# Altium schematic sheet BlindController.SchDoc: Blind Control Unit (VELUX)
size A4; Author: Vaclav Dvorak; DrawnBy: Vaclav Dvorak; Organization: ST Microelectronics; Address1: Pobrezni 3; Address2: 18600, Prague 8; Address3: Czech Republic; Revision: 0.1 EV0; SheetNumber: 1; SheetTotal: 1; PageSetup: Record=PageOptions|CenterHorizontal=True|CenterVertical=True|PrintScale=0.97|XCorrection=1.00|YCorrection=1.00|PrintKind=0|BorderSize=5000000|LeftOffset=0|BottomOffset=0|Orientation=2|PaperLength=1000|PaperWidth=1000|Scale=100|PaperSource=7|PrintQuality=-4|MediaType=1|DitherType=10|PaperKind=A4|PrintScaleMode=1
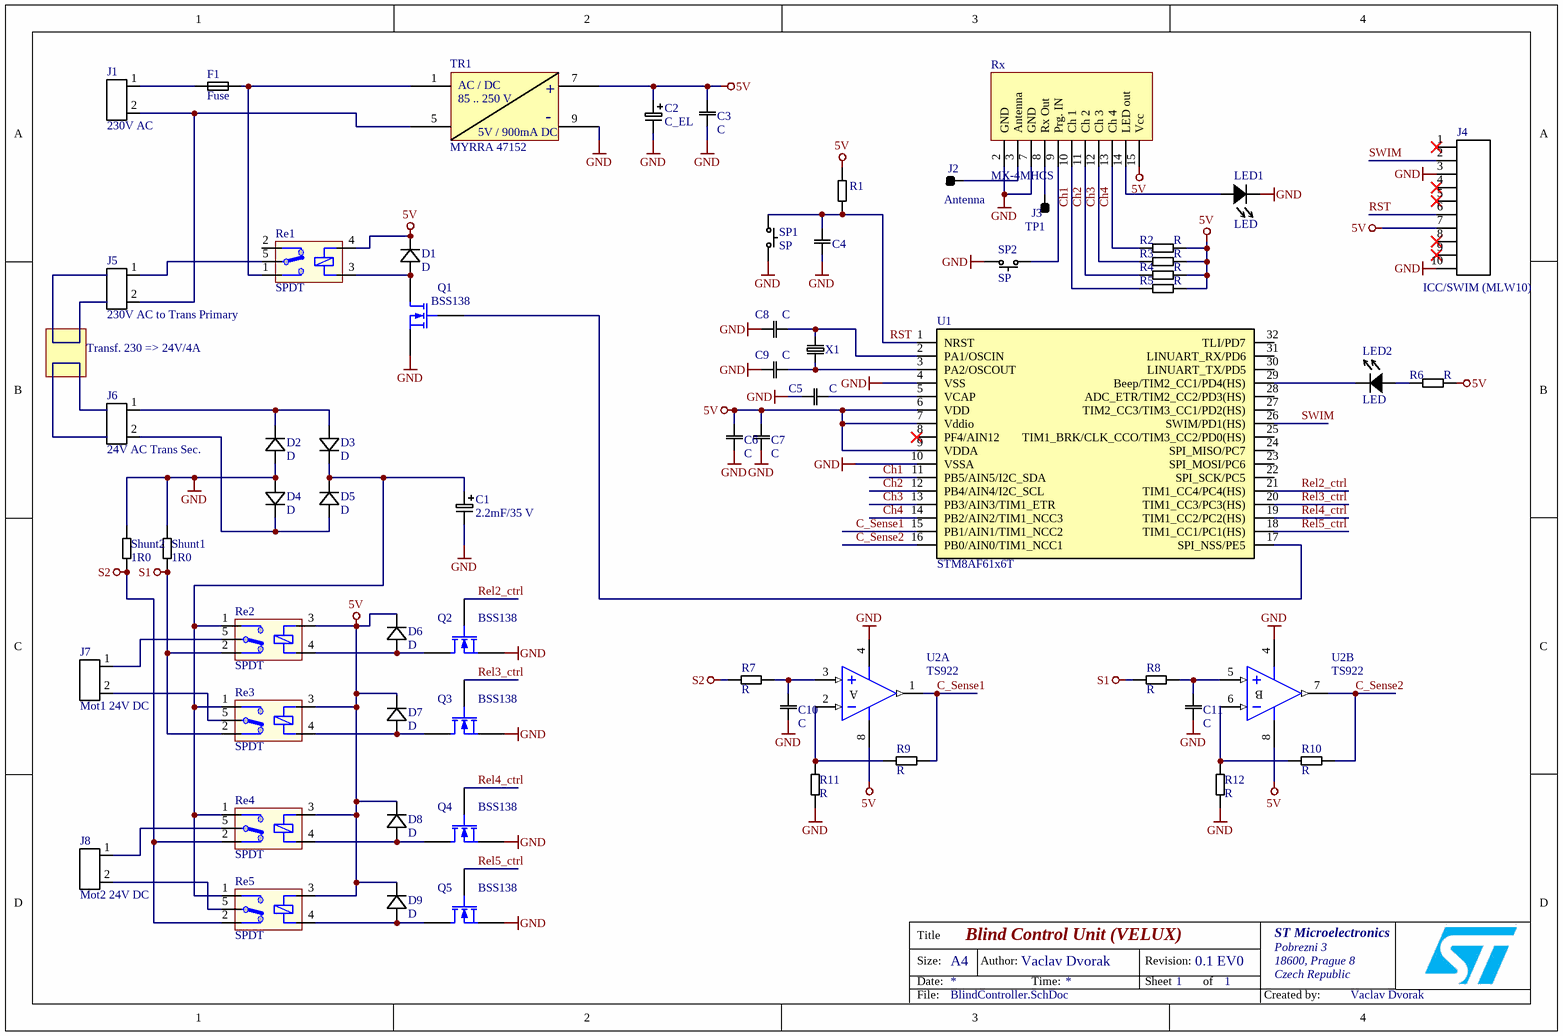
[diagram p0: BlindController.SchDoc]

## Parts
C1  2.2mF/35 V  [EL_10X13]
C2  C_EL  [EL_5x11]
C3  C  [C0805]
C4  (no value)  [C0805]
C5  C  [C0805]
C6  C  [C0805]
C7  C  [C0805]
C8  C  [C0805]
C9  C  [C0805]
C10  C  [C0805]
C11  C  [C0805]
D1  D  [SMA]
D2  D  [DO41]
D3  D  [DO41]
D4  D  [DO41]
D5  D  [DO41]
D6  D  [SMA]
D7  D  [SMA]
D8  D  [SMA]
D9  D  [SMA]
F1  Fuse  [AXIAL-0.5L]
J1  230V AC  [ARK_2]
J2  Antenna  [PIN]
J3  TP1  [PIN]
J4  ICC/SWIM (MLW10)  [MLW10]
J5  230V AC to Trans Primary  [ARK_2]
J6  24V AC Trans Sec.  [ARK_2]
J7  Mot1 24V DC  [ARK_2]
J8  Mot2 24V DC  [ARK_2]
LED1  LED  [LED_SMD]
LED2  LED  [LED_SMD]
Q1  BSS138  [SOT23]
Q2  BSS138  [SOT23]
Q3  BSS138  [SOT23]
Q4  BSS138  [SOT23]
Q5  BSS138  [SOT23]
R1  (no value)  [R0805]
R2  R  [R0805]
R3  R  [R0805]
R4  R  [R0805]
R5  R  [R0805]
R6  R  [R0805]
R7  R  [R0805]
R8  R  [R0805]
R9  R  [R0805]
R10  R  [R0805]
R11  R  [R0805]
R12  R  [R0805]
Re1  SPDT  [Rele_JS-K]
Re2  SPDT  [Rele_JS-K]
Re3  SPDT  [Rele_JS-K]
Re4  SPDT  [Rele_JS-K]
Re5  SPDT  [Rele_JS-K]
Rx  MX-4MHCS  [RX-4MHCS]
Shunt1  1R0  [R Shunt S-2]
Shunt2  1R0  [R Shunt S-2]
SP1  SP  [DIP_PUSH_BUTTON]
SP2  SP  [DIP_PUSH_BUTTON]
TR1  MYRRA 47152  [Myrra47000]
U1  STM8AF61x6T  [QFP32]
U2  TS922  [SO8_L]  (parts A,B of 2)
X1  (no value)  [HC-49U]

## Nets
5V: C2.1 C3.2 C6.2 C7.2 D1.2(K) D6.2(K) D7.2(K) D8.2(K) D9.2(K) J4.7 R1.1 R2.1 R3.1 R4.1 R5.1 R6.1 Re1.4 Re2.3 Re3.3 Re4.3 Re5.3 Rx.15(Vcc) TR1.7 U1.6(VDD) U1.7(Vddio) U1.9(VDDA) U2.8(V+)
GND: C1.2 C2.2 C3.1 C4.1 C5.1 C6.1 C7.1 C8.1 C9.1 C10.1 C11.1 D2.1(A) D4.1(A) J4.3 J4.10 LED1.2(K) Q1.2(S) Q2.2(S) Q3.2(S) Q4.2(S) Q5.2(S) R11.2 R12.2 Rx.2(GND) Rx.7(GND) Shunt1.1 Shunt2.1 SP1.2 SP2.2 TR1.9 U1.4(VSS) U1.10(VSSA) U2.4(V-)
S1: R8.1 Re2.2 Re3.2 Shunt1.2
S2: R7.1 Re4.2 Re5.2 Shunt2.2
C_Sense1: R9.1 U1.15(PB1/AIN1/TIM1_NCC2) U2.1(OUT)
C_Sense2: R10.1 U1.16(PB0/AIN0/TIM1_NCC1) U2.7(OUT)
Ch1: R5.2 Rx.10(Ch_1) U1.11(PB5/AIN5/I2C_SDA)
Ch2: R4.2 Rx.11(Ch_2) U1.12(PB4/AIN4/I2C_SCL)
Ch3: R3.2 Rx.12(Ch_3) U1.13(PB3/AIN3/TIM1_ETR)
Ch4: R2.2 Rx.13(Ch_4) U1.14(PB2/AIN2/TIM1_NCC3)
Rel2_ctrl: Q2.1(G) U1.21(TIM1_CC4/PC4(HS))
Rel3_ctrl: Q3.1(G) U1.20(TIM1_CC3/PC3(HS))
Rel4_ctrl: Q4.1(G) U1.19(TIM1_CC2/PC2(HS))
Rel5_ctrl: Q5.1(G) U1.18(TIM1_CC1/PC1(HS))
RST: C4.2 J4.6 R1.2 SP1.1 U1.1(NRST)
SWIM: J4.2 U1.26(SWIM/PD1(HS))
NetC1_1: C1.1 D3.2(K) D5.2(K) Re2.1 Re3.1 Re4.1 Re5.1
NetC5_2: C5.2 U1.5(VCAP)
NetC8_2: C8.2 U1.2(PA1/OSCIN) X1.1
NetC9_2: C9.2 U1.3(PA2/OSCOUT) X1.2
NetC10_2: C10.2 R7.2 U2.3(IN+)
NetC11_2: C11.2 R8.2 U2.5(IN+)
NetD1_1: D1.1(A) Q1.3(D) Re1.3
NetD2_2: D2.2(K) D3.1(A) J6.1
NetD4_2: D4.2(K) D5.1(A) J6.2
NetD6_1: D6.1(A) Q2.3(D) Re2.4
NetD7_1: D7.1(A) Q3.3(D) Re3.4
NetD8_1: D8.1(A) Q4.3(D) Re4.4
NetD9_1: D9.1(A) Q5.3(D) Re5.4
NetF1_1: F1.1 Re1.1 TR1.1
NetF1_2: F1.2 J1.1
NetJ1_2: J1.2 J5.2 TR1.5
NetJ2_1: J2.1 Rx.3(Antenna)
NetJ3_1: J3.1 Rx.8(Rx_Out)
NetJ5_1: J5.1 Re1.5
NetJ7_1: J7.1 Re2.5
NetJ7_2: J7.2 Re3.5
NetJ8_1: J8.1 Re4.5
NetJ8_2: J8.2 Re5.5
NetLED1_1: LED1.1(A) Rx.14(LED_out)
NetLED2_1: LED2.1(A) R6.2
NetLED2_2: LED2.2(K) U1.29(Beep/TIM2_CC1/PD4(HS))
NetQ1_1: Q1.1(G) U1.17(SPI_NSS/PE5)
NetR9_2: R9.2 R11.1 U2.2(IN-)
NetR10_2: R10.2 R12.1 U2.6(IN-)
NetRx_9: Rx.9(Prg._IN) SP2.1

Not connected (* = marked no-connect by the designer): J4 1* 4* 5* 8* 9*; Re1 2; U1 8(PF4/AIN12)* 22(SPI_SCK/PC5) 23(SPI_MOSI/PC6) 24(SPI_MISO/PC7) 25(TIM1_BRK/CLK_CCO/TIM3_CC2/PD0(HS)) 27(TIM2_CC3/TIM3_CC1/PD2(HS)) 28(ADC_ETR/TIM2_CC2/PD3(HS)) 30(LINUART_TX/PD5) 31(LINUART_RX/PD6) 32(TLI/PD7)

## Notes on the sheet
- Transf. 230 => 24V/4A
- Title
- Size:
- Date:
- A4
- Author:
- Time:
- Revision:
- Sheet
- of
- File:
- Created by:
- (in symbol MYRRA_AC_DC) AC / DC; +; 85 .. 250 V; -; 5V / 900mA DC
- (in symbol TS912ID, part A) A
- (in symbol TS912ID, part B) B

## Library data of the parts
C1 = C_EL_1
C4 = C
J1 J5-J8 = CON_2
J2 J3 = PIN
J4 = CON_10
Q1-Q5 = BSS138: N-Channel Enhancement Mode Vertical DMOS FET; Package Information: Latest Revision: 1996; Published: 17-Dec-2003; Datasheet: Latest Revision: Mar-96; Package Reference: SOT23; Publisher: Altium Limited
R1 Shunt1 Shunt2 = R
Re1-Re5 = Rele_SPDT: rele SPDT
Rx = RX-4MHCS
TR1 = MYRRA_AC_DC: AC/DC  IN:85..260 V AC(DC), OUT: 5V/900mA DC
U2 = TS912ID: Rail-to-Rail CMOS Dual Operational Amplifier; Published: 24-Aug-2001; LatestRevisionDate: 13-Apr-2006; LatestRevisionNote: IPC-7351 Footprint Added.; DatasheetVersion: Apr-1999; PackageVersion: Dec-2002; PackageReference: SO8; Publisher: Altium Limited; PackageDescription: 8-Pin Small Outline Integrated Circuit 1.27 mm Pitch; Code_JEDEC: MS-012-AA; Code_IPC: SOIC127P600-8; ComponentLink1Description: Manufacturer Link; ComponentLink1URL: http://www.st.com/; ComponentLink2Description: Datasheet; ComponentLink2URL: http://www.st.com/stonline/products/literature/ds/2325/ts912.pdf
X1 = XTALL